# Altium schematic sheet MEMS&RF.SchDoc
size A4
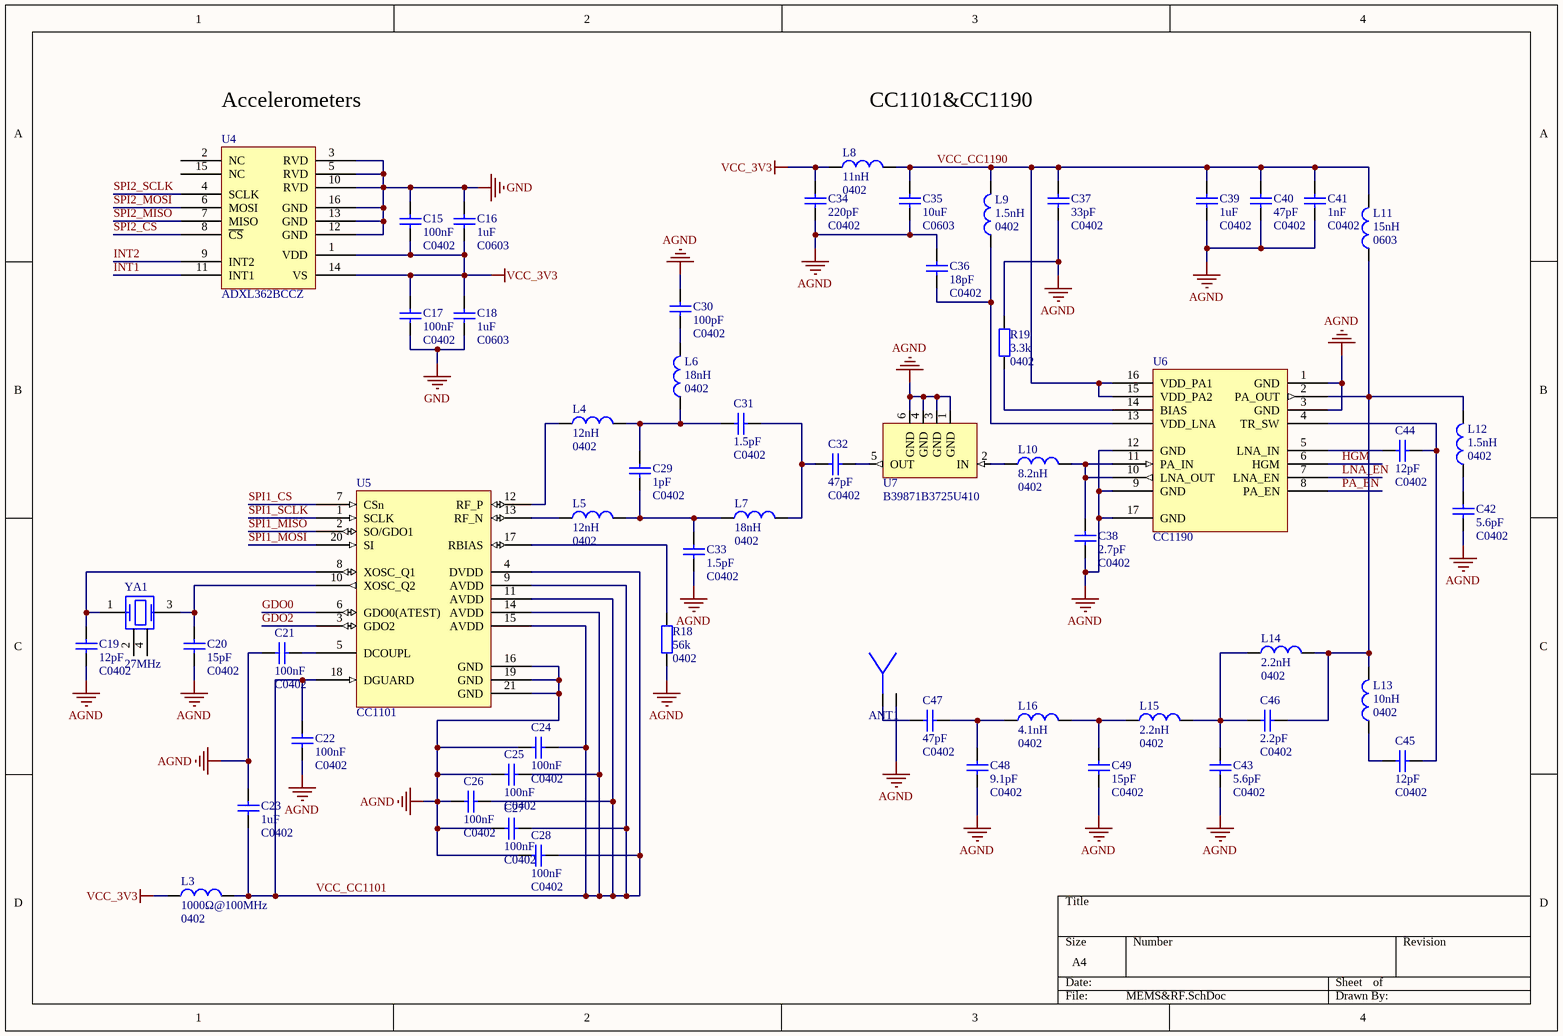
[diagram p0: MEMS&RF.SchDoc]

## Parts
ANT1  ANT  [SMB-xg]  (value not drawn)
C15  100nF  PackageReference: C0402  [0402]
C16  1uF  PackageReference: C0603  [1608[0603]]
C17  100nF  PackageReference: C0402  [0402]
C18  1uF  PackageReference: C0603  [1608[0603]]
C19  12pF  PackageReference: C0402  [0402]
C20  15pF  PackageReference: C0402  [0402]
C21  100nF  PackageReference: C0402  [0402]
C22  100nF  PackageReference: C0402  [0402]
C23  1uF  PackageReference: C0402  [0402]
C24  100nF  PackageReference: C0402  [0402]
C25  100nF  PackageReference: C0402  [0402]
C26  100nF  PackageReference: C0402  [0402]
C27  100nF  PackageReference: C0402  [0402]
C28  100nF  PackageReference: C0402  [0402]
C29  1pF  PackageReference: C0402  [0402]
C30  100pF  PackageReference: C0402  [0402]
C31  1.5pF  PackageReference: C0402  [0402]
C32  47pF  PackageReference: C0402  [0402]
C33  1.5pF  PackageReference: C0402  [0402]
C34  220pF  PackageReference: C0402  [0402]
C35  10uF  PackageReference: C0603  [1608[0603]]
C36  18pF  PackageReference: C0402  [0402]
C37  33pF  PackageReference: C0402  [0402]
C38  2.7pF  PackageReference: C0402  [0402]
C39  1uF  PackageReference: C0402  [0402]
C40  47pF  PackageReference: C0402  [0402]
C41  1nF  PackageReference: C0402  [0402]
C42  5.6pF  PackageReference: C0402  [0402]
C43  5.6pF  PackageReference: C0402  [0402]
C44  12pF  PackageReference: C0402  [0402]
C45  12pF  PackageReference: C0402  [0402]
C46  2.2pF  PackageReference: C0402  [0402]
C47  47pF  PackageReference: C0402  [0402]
C48  9.1pF  PackageReference: C0402  [0402]
C49  15pF  PackageReference: C0402  [0402]
L3  1000Ω@100MHz  [0402]
L4  12nH  [0402]
L5  12nH  [0402]
L6  18nH  [0402]
L7  18nH  [0402]
L8  11nH  [0402]
L9  1.5nH  [0402]
L10  8.2nH  [0402]
L11  15nH  PackageReference: 0603  [1608[0603]]
L12  1.5nH  [0402]
L13  10nH  [0402]
L14  2.2nH  [0402]
L15  2.2nH  [0402]
L16  4.1nH  [0402]
R18  56k  PackageReference: 0402  [RESC1005X04N]
R19  3.3k  PackageReference: 0402  [RESC1005X04N]
U4  ADXL362BCCZ  [LGA_CC-16-4]
U5  CC1101  [QFN50P400X400X100_HS-21N]
U6  CC1190  [QFN65P400X400X100_HS-17N]
U7  B39871B3725U410  [DCC6C]
YA1  27MHz  [XTAL-SMT-4P]

## Nets
AGND: ANT1.2(GND) C19.1 C20.1 C21.1 C22.1 C23.2 C24.2 C25.2 C26.2 C27.2 C28.2 C30.2 C33.1 C34.1 C35.1 C36.2 C37.1 C38.1 C39.1 C40.1 C41.1 C42.1 C43.1 C48.1 C49.1 R18.1 R19.2 U5.16(GND) U5.19(GND) U5.21(GND) U6.1(GND) U6.3(GND) U6.9(GND) U6.12(GND) U6.17(GND) U7.1(GND) U7.3(GND) U7.4(GND) U7.6(GND)
GND: C15.1 C16.2 C17.2 C18.1 U4.3(RVD) U4.5(RVD) U4.10(RVD) U4.12(GND) U4.13(GND) U4.16(GND)
VCC_3V3: C15.2 C16.1 C17.1 C18.2 C34.2 L3.1 L8.1 U4.1(VDD) U4.14(VS)
GDO0: U5.6(GDO0(ATEST))
GDO2: U5.3(GDO2)
HGM: U6.6(HGM)
INT1: U4.11(INT1)
INT2: U4.9(INT2)
LNA_EN: U6.7(LNA_EN)
PA_EN: U6.8(PA_EN)
SPI1_CS: U5.7(CSn)
SPI1_MISO: U5.2(SO/GDO1)
SPI1_MOSI: U5.20(SI)
SPI1_SCLK: U5.1(SCLK)
SPI2_CS: U4.8(~{CS})
SPI2_MISO: U4.7(MISO)
SPI2_MOSI: U4.6(MOSI)
SPI2_SCLK: U4.4(SCLK)
VCC_CC1101: C22.2 C23.1 C24.1 C25.1 C26.1 C27.1 C28.1 L3.2 U5.4(DVDD) U5.9(AVDD) U5.11(AVDD) U5.14(AVDD) U5.15(AVDD) U5.18(DGUARD)
VCC_CC1190: C35.2 C37.2 C39.2 C40.2 C41.2 L8.2 L9.2 L11.2 U6.15(VDD_PA2) U6.16(VDD_PA1)
NetANT1_1: ANT1.1(Antenna) C47.1
NetC19_2: C19.2 U5.8(XOSC_Q1) YA1.1
NetC20_2: C20.2 U5.10(XOSC_Q2) YA1.3
NetC21_2: C21.2 U5.5(DCOUPL)
NetC29_1: C29.1 C33.2 L5.2 L7.1
NetC29_2: C29.2 C31.1 L4.2 L6.1
NetC30_1: C30.1 L6.2
NetC31_2: C31.2 C32.1 L7.2
NetC32_2: C32.2 U7.5(OUT)
NetC36_1: C36.1 L9.1 U6.13(VDD_LNA)
NetC38_2: C38.2 L10.2 U6.10(LNA_OUT) U6.11(PA_IN)
NetC42_2: C42.2 L12.1
NetC43_2: C43.2 C46.1 L14.1 L15.2
NetC44_1: C44.1 U6.5(LNA_IN)
NetC44_2: C44.2 C45.2 U6.4(TR_SW)
NetC45_1: C45.1 L13.1
NetC46_2: C46.2 L11.1 L12.2 L13.2 L14.2 U6.2(PA_OUT)
NetC47_2: C47.2 C48.2 L16.1
NetC49_2: C49.2 L15.1 L16.2
NetL4_1: L4.1 U5.12(RF_P)
NetL5_1: L5.1 U5.13(RF_N)
NetL10_1: L10.1 U7.2(IN)
NetR18_2: R18.2 U5.17(RBIAS)
NetR19_1: R19.1 U6.14(BIAS)

Not connected (* = marked no-connect by the designer): U4 2(NC) 15(NC); YA1 2 4

## Notes on the sheet
- (near U4) Accelerometers
- CC1101&CC1190

## Library data of the parts
ANT1 = ANT: Antenna,GPS_ANT_IPX
C15 C17 = C1005X7R1H104K050BE: Capacitor (0402,X7R,100nF,DC 50V,±10%) TDK; Published: 8-Jun-2000; LatestRevisionDate: 29-May-2009; LatestRevisionNote: IPC-7351 Footprint Added.; Publisher: Altium Limited; PackageDescription: Chip Capacitor; Value: 100nF
C16 C18 = CGA3E2X5R1A105K080AA: Capacitor (0603,X5R,1uF,DC 10V,+/-10%) TDK; Published: 8-Jun-2000; LatestRevisionDate: 29-May-2009; LatestRevisionNote: IPC-7351 Footprint Added.; Publisher: Altium Limited; PackageDescription: Chip Capacitor; Value: 1uF
C19 C44 C45 = GRM1555C1H120JZ01D: Capacitor (0402,NP0,12pF,DC 50V,±5%) Murata; Published: 8-Jun-2000; LatestRevisionDate: 29-May-2009; LatestRevisionNote: IPC-7351 Footprint Added.; Publisher: Altium Limited; PackageDescription: Chip Capacitor; Value: 12pF
C20 C49 = GRM1555C1H150JZ01D: Capacitor (0402,NP0,15pF,DC 50V,±5%) Murata; Published: 8-Jun-2000; LatestRevisionDate: 29-May-2009; LatestRevisionNote: IPC-7351 Footprint Added.; Publisher: Altium Limited; PackageDescription: Chip Capacitor; Value: 15pF
C21 C22 C24-C28 = GRM155R71A104KA01D: Capacitor (0402,X5R,100nF,DC 10V,±10%) Murata; Published: 8-Jun-2000; LatestRevisionDate: 29-May-2009; LatestRevisionNote: IPC-7351 Footprint Added.; Publisher: Altium Limited; PackageDescription: Chip Capacitor; Value: 100nF
C23 C39 = GRM155R60J105KE19D: Capacitor (0402,X5R,1uF,DC 6.3V,±10%) Murata; Published: 8-Jun-2000; LatestRevisionDate: 29-May-2009; LatestRevisionNote: IPC-7351 Footprint Added.; Publisher: Altium Limited; PackageDescription: Chip Capacitor; Value: 1uF
C29 = GRM1555C1H1R0CZ01D: Capacitor (0402,NP0,1pF,DC 50V,±0.25pF) Murata; Published: 8-Jun-2000; LatestRevisionDate: 29-May-2009; LatestRevisionNote: IPC-7351 Footprint Added.; Publisher: Altium Limited; PackageDescription: Chip Capacitor; Value: 1pF
C30 = GRM1555C1H101JZ01D: Capacitor (0402,NP0,100pF,DC 50V,±5%) Murata; Published: 8-Jun-2000; LatestRevisionDate: 29-May-2009; LatestRevisionNote: IPC-7351 Footprint Added.; Publisher: Altium Limited; PackageDescription: Chip Capacitor; Value: 100pF
C31 C33 = GRM1555C1H1R5CZ01D: Capacitor (0402,NP0,1.5pF,DC 50V,±0.25pF) Murata; Published: 8-Jun-2000; LatestRevisionDate: 29-May-2009; LatestRevisionNote: IPC-7351 Footprint Added.; Publisher: Altium Limited; PackageDescription: Chip Capacitor; Value: 1.5pF
C32 C40 C47 = GRM1555C1H470JZ01D: Capacitor (0402,NP0,47pF,DC 50V,±5%) Murata; Published: 8-Jun-2000; LatestRevisionDate: 29-May-2009; LatestRevisionNote: IPC-7351 Footprint Added.; Publisher: Altium Limited; PackageDescription: Chip Capacitor; Value: 47pF
C34 = GRM1555C1H221JA01D: Capacitor (0402,NP0,220pF,DC 50V,±5%) Murata; Published: 8-Jun-2000; LatestRevisionDate: 29-May-2009; LatestRevisionNote: IPC-7351 Footprint Added.; Publisher: Altium Limited; PackageDescription: Chip Capacitor; Value: 220pF
C35 = GRM188R60G106ME47D: Capacitor (0603,X5R,10uF,DC 4V,+/-20%) Murata; Published: 8-Jun-2000; LatestRevisionDate: 29-May-2009; LatestRevisionNote: IPC-7351 Footprint Added.; Publisher: Altium Limited; PackageDescription: Chip Capacitor; Value: 10uF
C36 = GRM1555C1H180JZ01D: Capacitor (0402,NP0,18pF,DC 25V,±5%) Murata; Published: 8-Jun-2000; LatestRevisionDate: 29-May-2009; LatestRevisionNote: IPC-7351 Footprint Added.; Publisher: Altium Limited; PackageDescription: Chip Capacitor; Value: 18pF
C37 = GRM1555C1H330JZ01D: Capacitor (0402,NP0,33pF,DC 50V,±5%) Murata; Published: 8-Jun-2000; LatestRevisionDate: 29-May-2009; LatestRevisionNote: IPC-7351 Footprint Added.; Publisher: Altium Limited; PackageDescription: Chip Capacitor; Value: 33pF
C38 = GRM1555C1H2R7CZ01D: Capacitor (0402,NP0,2.7pF,DC 50V,±0.25pF) Murata; Published: 8-Jun-2000; LatestRevisionDate: 29-May-2009; LatestRevisionNote: IPC-7351 Footprint Added.; Publisher: Altium Limited; PackageDescription: Chip Capacitor; Value: 2.7pF
C41 = GRM1555C1H102JA01D: Capacitor (0402,NP0,1nF,DC 50V,±5%) Murata; Published: 8-Jun-2000; LatestRevisionDate: 29-May-2009; LatestRevisionNote: IPC-7351 Footprint Added.; Publisher: Altium Limited; PackageDescription: Chip Capacitor; Value: 1nF
C42 C43 = GRM1555C1H5R6CZ01D: Capacitor (0402,NP0,5.6pF,DC 50V,±0.25pF) Murata; Published: 8-Jun-2000; LatestRevisionDate: 29-May-2009; LatestRevisionNote: IPC-7351 Footprint Added.; Publisher: Altium Limited; PackageDescription: Chip Capacitor; Value: 5.6pF
C46 = GRM1555C1H2R2CZ01: Capacitor (0402,NP0,2.2pF,DC 50V,±0.25pF) Murata; Published: 8-Jun-2000; LatestRevisionDate: 29-May-2009; LatestRevisionNote: IPC-7351 Footprint Added.; Publisher: Altium Limited; PackageDescription: Chip Capacitor; Value: 2.2pF
C48 = GRM1555C1H9R1CA01D: Capacitor (0402,NP0,9.1pF,DC 50V,±0.25pF) Murata; Published: 8-Jun-2000; LatestRevisionDate: 29-May-2009; LatestRevisionNote: IPC-7351 Footprint Added.; Publisher: Altium Limited; PackageDescription: Chip Capacitor; Value: 9.1pF
L3 = BLM15HG102SN1D: Inductor,EMI filter bead, 1000Ω@100MHz 250mA, 0402 1k ohms Tape GHz Band Gen Use, Murata; Published: 8-Jun-2000; LatestRevisionDate: 29-May-2009; LatestRevisionNote: IPC-7351 Footprint Added.; Publisher: Altium Limited; PackageDescription: Inductor; Value: 1000Ω@100MHz; PackageReference: 0402
L4 L5 = LQW15AN12NJ00D: Inductor, 12n, 0402, ±5%, wire-wound type Murata; Published: 8-Jun-2000; LatestRevisionDate: 29-May-2009; LatestRevisionNote: IPC-7351 Footprint Added.; Publisher: Altium Limited; PackageDescription: Inductor; Value: 12nH; PackageReference: 0402
L6 L7 = LQW15AN18NJ00D: Inductor, 18n, 0402, ±5%, wire-wound type Murata; Published: 8-Jun-2000; LatestRevisionDate: 29-May-2009; LatestRevisionNote: IPC-7351 Footprint Added.; Publisher: Altium Limited; PackageDescription: Inductor; Value: 18nH; PackageReference: 0402
L8 = LQW15AN11NJ00: Inductor, 11n, 0402, ±5%, wire-wound type Murata; Published: 8-Jun-2000; LatestRevisionDate: 29-May-2009; LatestRevisionNote: IPC-7351 Footprint Added.; Publisher: Altium Limited; PackageDescription: Inductor; Value: 11nH; PackageReference: 0402
L9 L12 = LQG15HS1N5S02D: Inductor, 1n5, 0402, Monolithic type, +/-0.3 nH Murata; Published: 8-Jun-2000; LatestRevisionDate: 29-May-2009; LatestRevisionNote: IPC-7351 Footprint Added.; Publisher: Altium Limited; PackageDescription: Inductor; Value: 1.5nH; PackageReference: 0402
L10 = LQG15HS8N2J02D: Inductor, 8n2, 0402, ±5% / Murata; Published: 8-Jun-2000; LatestRevisionDate: 29-May-2009; LatestRevisionNote: IPC-7351 Footprint Added.; Publisher: Altium Limited; PackageDescription: Inductor; Value: 8.2nH; PackageReference: 0402
L11 = LQW18AN15NJ00: Inductor, 15n, 0603, ±5%, wire-wound type Murata; Published: 8-Jun-2000; LatestRevisionDate: 29-May-2009; LatestRevisionNote: IPC-7351 Footprint Added.; Publisher: Altium Limited; PackageDescription: Inductor; Value: 15nH
L13 = LQW15AN10NJ00D: Inductor, 10n, 0402, ±5%, wire-wound type Murata; Published: 8-Jun-2000; LatestRevisionDate: 29-May-2009; LatestRevisionNote: IPC-7351 Footprint Added.; Publisher: Altium Limited; PackageDescription: Inductor; Value: 10nH; PackageReference: 0402
L14 L15 = LQW15AN2N2C10D: Inductor, 2n2, 0402, wire-wound type, +/- 0.2 nH Murata; Published: 8-Jun-2000; LatestRevisionDate: 29-May-2009; LatestRevisionNote: IPC-7351 Footprint Added.; Publisher: Altium Limited; PackageDescription: Inductor; Value: 2.2nH; PackageReference: 0402
L16 = LQW15AN4N1C00: Inductor, 4n1, 0402, +/-0.2nH, wire-wound type Murata; Published: 8-Jun-2000; LatestRevisionDate: 29-May-2009; LatestRevisionNote: IPC-7351 Footprint Added.; Publisher: Altium Limited; PackageDescription: Inductor; Value: 4.1nH; PackageReference: 0402
R18 = RK73H1ETTP5602F: Resistor, 56k ohms, 0402, ±1% Koa; PackageDescription: Chip Resistor, 2-Leads, Body 1.00x0.50mm, IPC Medium Density; Value: 56k
R19 = RK73H1ETTP3301F: Resistor, 3.3k ohms, 0402, ±1% Koa; PackageDescription: Chip Resistor, 2-Leads, Body 1.00x0.50mm, IPC Medium Density; Value: 3.3k
U4 = ADXL362BCCZ: ADXL362, LGA, CC-16-4.
U5 = CC1101: Low-Power Sub-1GHz RF Transceiver
U6 = CC1190: 850– 950MHzRFFrontEnd
U7 = B39871B3725U410: SAW RF filter,Low-loss RF filter for remote control receivers,Center frequency 69 MHz,Usable pass band 2MHz
YA1 = NX3225GA: Crystal, 27.000000MHz, 10.0pF, 50 ohms max, NDK; Valid: 27MHz